# Altium schematic sheet LoRa_RX.SchDoc
size A
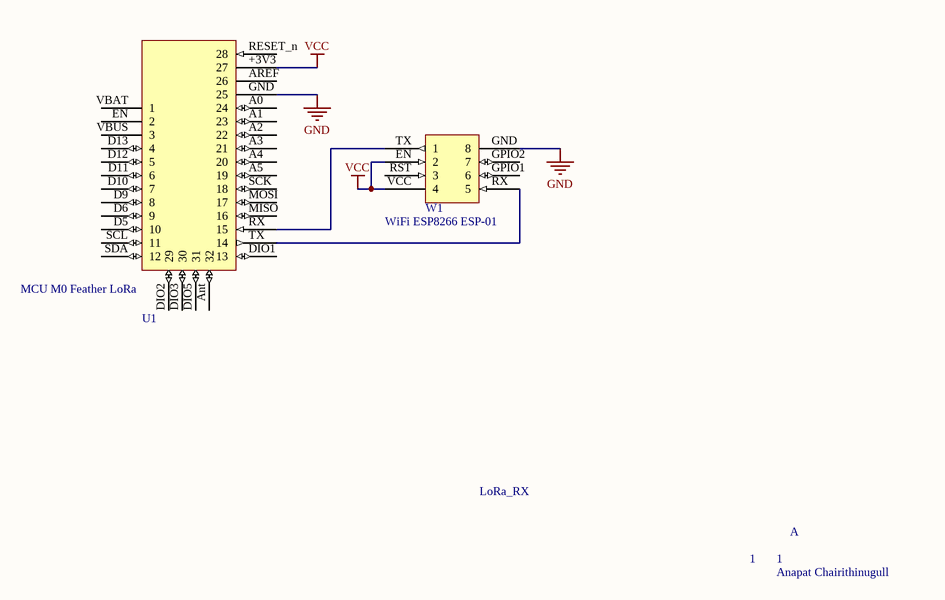
[diagram p0: LoRa_RX.SchDoc]

## Parts
U1  MCU M0 Feather LoRa
W1  WiFi ESP8266 ESP-01

## Nets
GND: U1.GND(25) W1.GND(8)
VCC: U1.+3V3(27) W1.EN(2) W1.VCC(4)
NetU1_RX: U1.RX(15) W1.TX(1)
NetU1_TX: U1.TX(14) W1.RX(5)

Not connected (* = marked no-connect by the designer): U1 A0(24) A1(23) A2(22) A3(21) A4(20) A5(19) Ant(32) AREF(26) D5(10) D6(9) D9(8) D10(7) D11(6) D12(5) D13(4) DIO1(13) DIO2(29) DIO3(30) DIO5(31) EN(2) MISO(16) MOSI(17) RESET_n(28) SCK(18) SCL(11) SDA(12) VBAT(1) VBUS(3); W1 GPIO1(6) GPIO2(7) RST(3)

## Notes on the sheet
- LoRa_RX
- 1
- A
- Anapat Chairithinugull